# EAGLE design BackscatterPlantSensor_v6_1soic_coax_rmi_2layer (EAGLE 6.4)

## Sheet 1 of 4
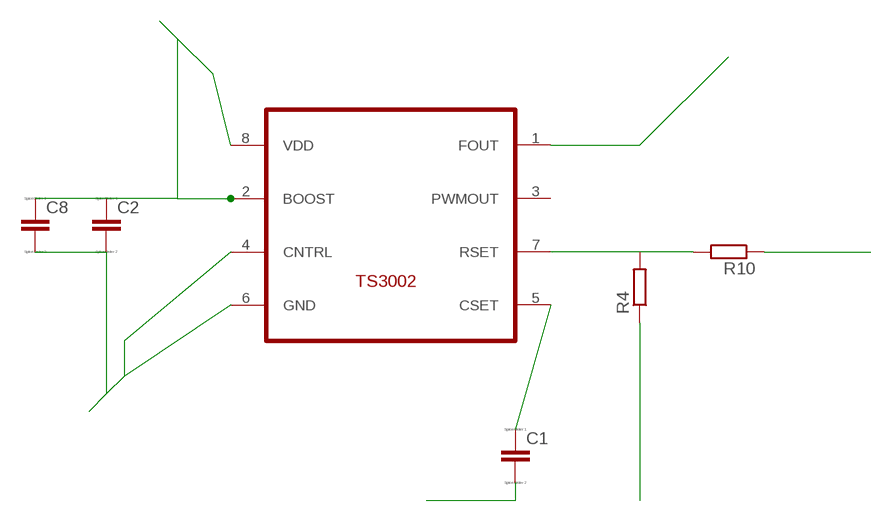
[diagram p0: schematic, sheet 1]

### Parts
C1  CC0603  [C0603]
C2  CC0603  [C0603]
C8  CC0603  [C0603]
R4  R-EU_R0603  [R0603]
R10  R-EU_R0603  [R0603]
U$1  TS3002  [TDFN22-8]

### Nets
AGND: R4.1 ; also sheet 4
DGND: C1.2 C2.2 C8.2 U$1.4(CNTRL) U$1.6(GND) ; also sheet 2
FOUT: U$1.1(FOUT) ; also sheet 2
N$1: C1.1 U$1.5(CSET)
N$2: R4.2 R10.2 U$1.7(RSET)
VCOND: R10.1 ; also sheet 4
VDD: C2.1 C8.1 U$1.2(BOOST) U$1.8(VDD) ; also sheet 3,4
Unconnected: U$1.3(PWMOUT)

## Sheet 2 of 4
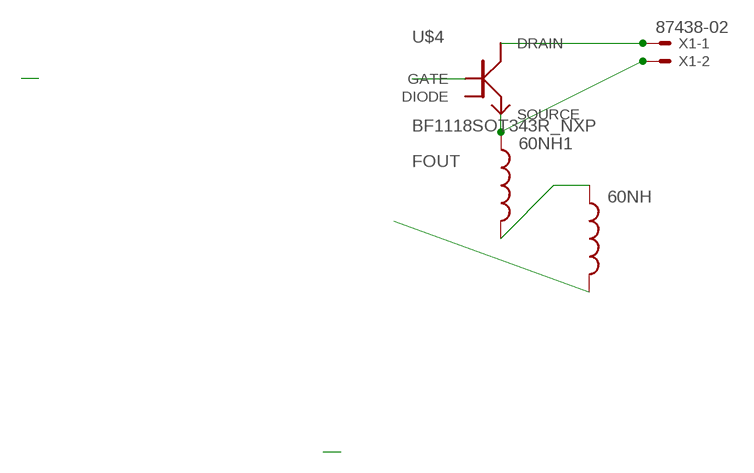
[diagram p1: schematic, sheet 2]

### Parts
60NH  INDUCTOR0402  [C0402]
60NH1  INDUCTOR0402  [C0402]
U$4  BF1118SOT343R_NXP  [SOT343R]
X1  87438-02  [87438-02]

### Nets
DGND: U$4.1(GATE) ; also sheet 1
FOUT: 60NH.2 ; also sheet 1
N$3: 60NH1.2 60NH.1
RF_MINUS: 60NH1.1 U$4.3(SOURCE) X1.2
RF_PLUS: U$4.4(DRAIN) X1.1
Unconnected: U$4.2(DIODE)

## Sheet 3 of 4
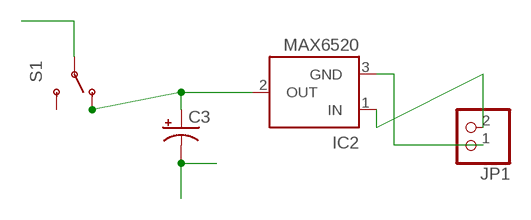
[diagram p2: schematic, sheet 3]

### Parts
C3  CAP_POL1206  [EIA3216]
IC2  MAX6520  [SOT23]
JP1  PINHD-1X2  [1X02]
S1  SWITCH-SPDTPTH  [SWITCH-SPDT]

### Nets
GND: C3.C(-) IC2.3(GND) JP1.1
N$4: IC2.1(IN) JP1.2
N$7: C3.A(+) IC2.2(OUT) S1.1(O)
VDD: S1.2(P) ; also sheet 1,4
Unconnected: S1.3(S)

## Sheet 4 of 4
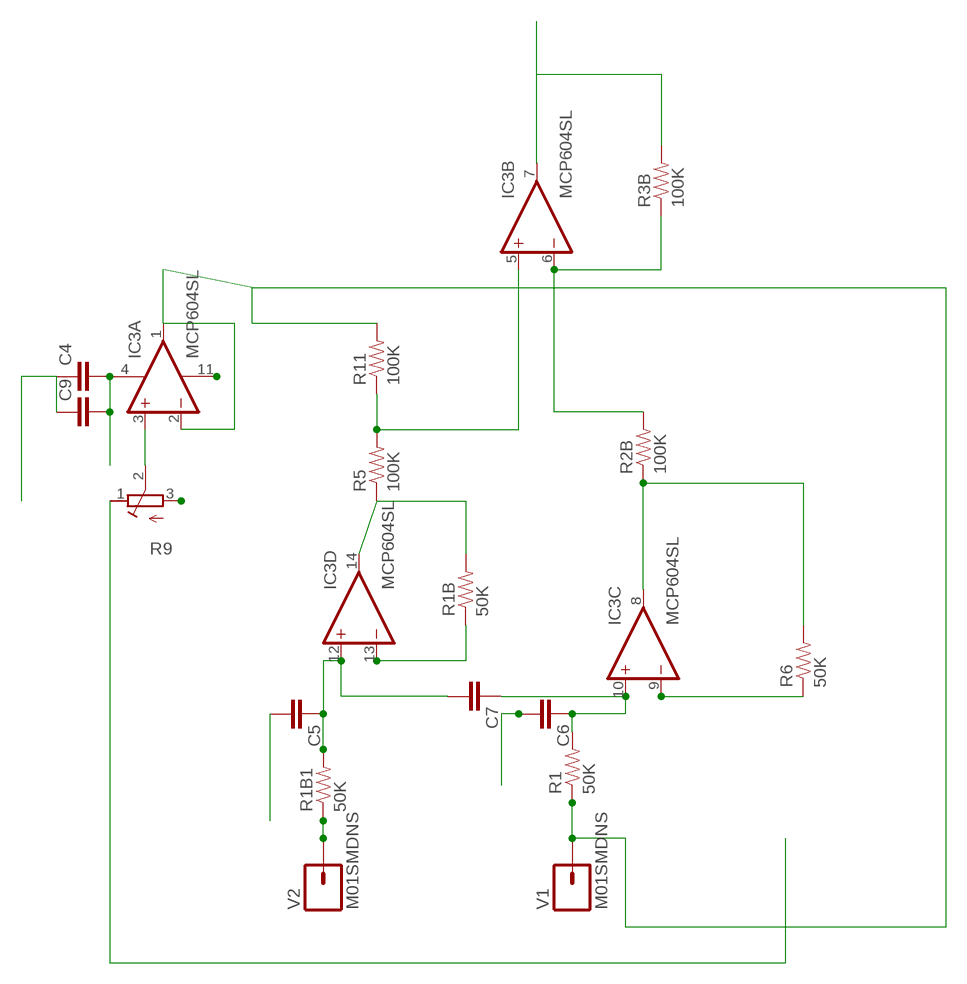
[diagram p3: schematic, sheet 4]

### Parts
C4  CAP0603-CAP  [0603-CAP]
C5  CAP0603-CAP  [0603-CAP]
C6  CAP0603-CAP  [0603-CAP]
C7  CAP0603-CAP  [0603-CAP]
C9  CAP0603-CAP  [0603-CAP]
IC3  MCP604SL  [SO14]
R1  50K  RESISTOR  [0805]
R1B  50K  RESISTOR  [0805]
R1B1  50K  RESISTOR  [0805]
R2B  100K  RESISTOR  [0805]
R3B  100K  RESISTOR  [0805]
R5  100K  RESISTOR  [0805]
R6  50K  RESISTOR  [0805]
R9  R-TRIMM3314G  [RTRIM3314G]
R11  100K  RESISTOR  [0805]
V1  M01SMDNS  [1X01NS]
V2  M01SMDNS  [1X01NS]

### Nets
AGND: C4.1 C5.2 C6.2 C9.1 IC3.11(P:V-) R9.3(A) ; also sheet 1
N$10: IC3.9(C:-IN) R6.1
N$12: C5.1 C7.2 IC3.12(D:+IN) R1B1.2
N$13: R1B1.1 V2.1
N$23: IC3.8(C:OUT) R2B.1 R6.2
N$49: IC3.14(D:OUT) R1B.2 R5.1
N$58: IC3.6(B:-IN) R2B.2 R3B.1
N$84: C6.1 C7.1 IC3.10(C:+IN) R1.2
N$105: IC3.3(A:+IN) R9.2(S)
N$107: IC3.13(D:-IN) R1B.1
N$118: IC3.5(B:+IN) R5.2 R11.1
VCOND: IC3.7(B:OUT) R3B.2 ; also sheet 1
VDD: C4.2 C9.2 IC3.4(P:V+) R9.1(E) ; also sheet 1,3
VRF1: IC3.1(A:OUT) IC3.2(A:-IN) R1.1 R11.2 V1.1

## Library data of the parts
60NH 60NH1 = SparkFun:INDUCTOR: Inductors Basic Inductor/Choke - 0603 and 1206. Footprints are not proven and vary greatly between part numbers.
C1 C2 C8 = eagle-ltspice:C: CAPACITOR, European symbol; SPICEMODEL: NONE; SPICEPREFIX: C
C3 = SparkFun-Capacitors:CAP_POL: Capacitor Polarized These are standard SMD and PTH capacitors. Normally 10uF, 47uF, and 100uF in electrolytic and tantalum varieties. Always verify the external diameter of the through hole cap, it varies with capacity, voltage, and manufacturer. The EIA devices should be standard.
C4-C7 C9 = SparkFun-Passives:CAP: Capacitor Standard 0603 ceramic capacitor, and 0.1" leaded capacitor.
IC2 = maxim:MAX6520: 1.2V Voltage Reference 50ppm/°C, SOT23, 3-Terminal Source: Data sheet <http://datasheets.maxim-ic.com/en/ds/MAX6520.pdf>; MF: MAXIM; MPN: MAX6520EUR-T; OC_FARNELL: unknown; OC_NEWARK: 02J4586
IC3 = linear:MCP604: Quad Op Amp 2.7V to 6.0V Single Supply CMOS Source: http://ww1.microchip.com/downloads/en/DeviceDoc/21314g.pdf
JP1 = pinhead:PINHD-1X2: PIN HEADER
R1 R1B R1B1 R2B R3B R5 R6 R11 = SparkFun:RESISTOR: Resistor Basic schematic elements and footprints for 0603, 1206, and PTH 1/10th watt (small) resistors.
R4 R10 = rcl:R-EU_: RESISTOR, European symbol
R9 = rcl:R-TRIMM: Trimm resistor
S1 = semipassiveTag_library:SWITCH-SPDT: SPST Switch Simple slide switch. Spark Fun Electronics SKU : COM-00102
U$1 = ts3002TDFN22_8pin:TS3002
U$4 = rf_transistors:BF1118
V1 V2 = SparkFun-Connectors:M01: Header 1 Standard 1-pin 0.1" header. Use with straight break away headers (SKU : PRT-00116), right angle break away headers (PRT-00553), swiss pins (PRT-00743), machine pins (PRT-00117), and female headers (PRT-00115).
X1 = con-molex:87438-02: Wire-to-Board 1.50mm (.059") Pitch Header - Right Angle, SMT, Shrouded Source: http://www.molex.com/product/micro/87438.html; OC_FARNELL: 1711327; OC_NEWARK: unknown

## Board
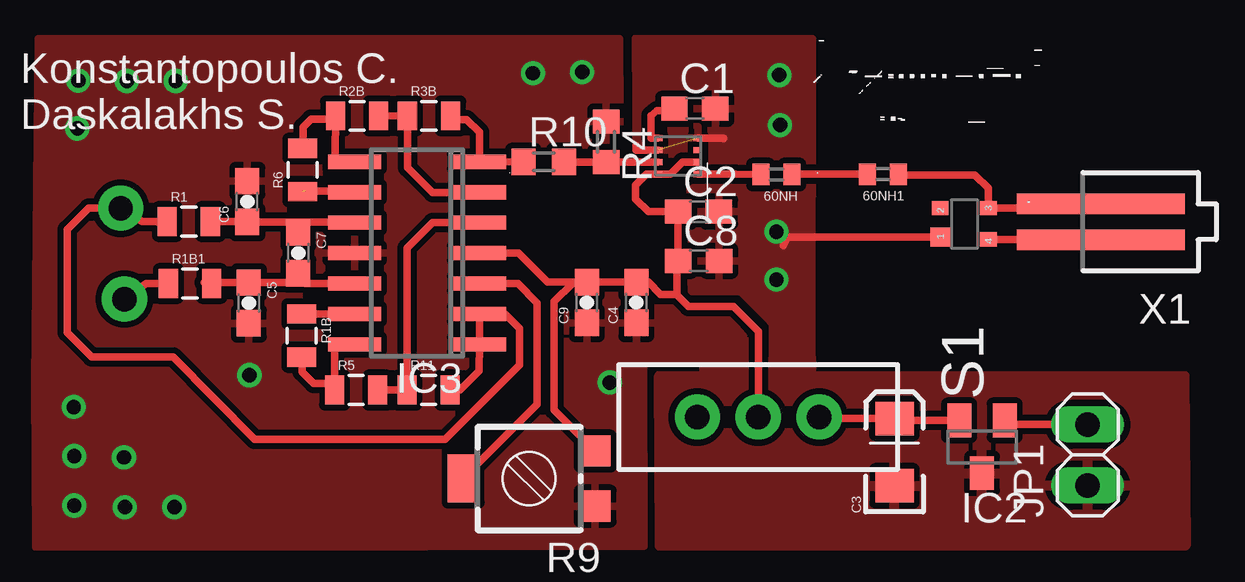
[diagram p4: board, top side]
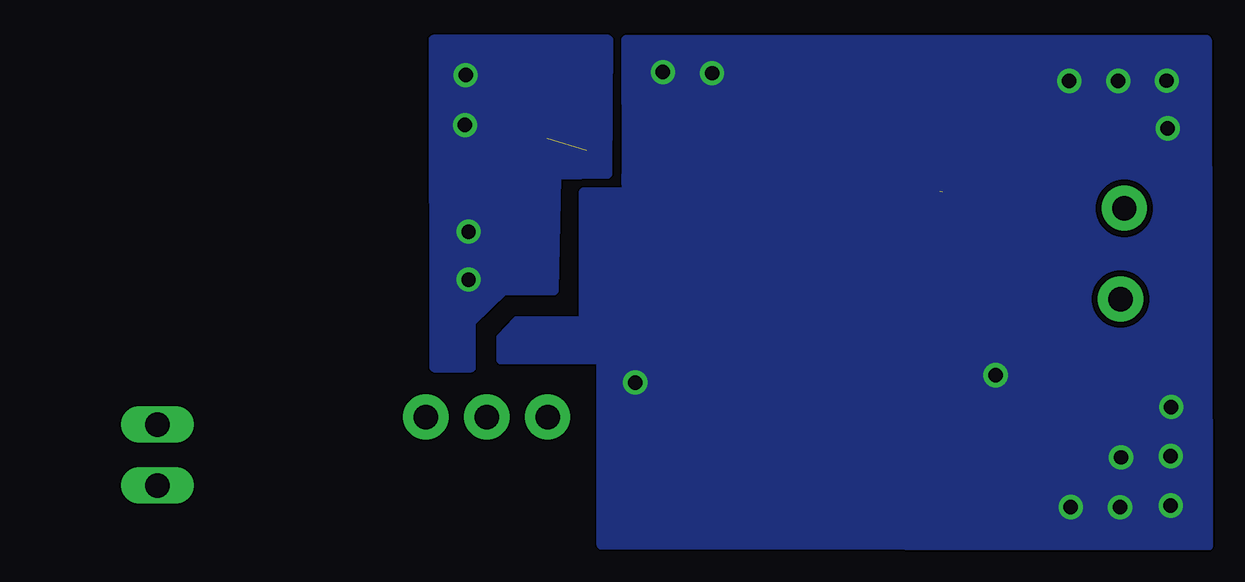
[diagram p5: board, bottom side, seen from below]

No outline drawn. Coordinates in mm, seen from the top.
Copper layers (1*16): Top 0.035mm / dielectric 1.5mm / Bottom 0.035mm
Design rules "default *": minimum track width 10mil, minimum drill 24mil, track to track 10mil, track to pad 10mil, pad to pad 10mil, via to via 10mil, smd to smd 10mil, copper to edge 40mil, drill to drill 8mil, minimum pad ring 10mil, minimum via ring 8mil, stop-mask expansion 4mil, vias tented up to drill 0mil, thermal gap 10mil

### Footprints (pad centres in the part's own frame; a part is rotated, then mirrored left to right if it is on the bottom)
C0402 = smd 0.7 x 0.9: 1 -0.65,0; 2 0.65,0
C0603 = smd 1.1 x 1: 1 -0.85,0; 2 0.85,0
EIA3216 = smd 1.4 x 1.6: A 1.4,0; C -1.4,0
0603-CAP = smd 1.1 x 1: 1 -0.85,0; 2 0.85,0
SOT23 = smd 1 x 1.4: 1 -0.95,-1.1; 2 0.95,-1.1; 3 0,1.1
SO14 = smd 0.6 x 2.2: 1 -3.81,-2.6; 2 -2.54,-2.6; 3 -1.27,-2.6; 4 0,-2.6; 5 1.27,-2.6; 6 2.54,-2.6; 7 3.81,-2.6; 8 3.81,2.6; 9 2.54,2.6; 10 1.27,2.6; 11 0,2.6; 12 -1.27,2.6; 13 -2.54,2.6; 14 -3.81,2.6
1X02 = drill 1.016 long: 1 -1.27,0; 2 1.27,0
0805 = smd 0.8 x 1.2: 1 -0.9,0; 2 0.9,0
R0603 = smd 1 x 1.1: 1 -0.85,0; 2 0.85,0
RTRIM3314G = smd 1.3 x 1.3: 1 1.15,-2.75; 3 -1.15,-2.75 | smd 2 x 1.3: 2 0,2.75
SWITCH-SPDT = drill 1.016 pad 1.88: 1 0,2.54; 2 0,0; 3 0,-2.54
TDFN22-8 = smd 0.35 x 0.25: 1 -1.78,-0.7; 2 -1.78,-1.2; 3 -1.78,-1.7; 4 -1.78,-2.2; 5 -0.13,-2.2; 6 -0.13,-1.7; 7 -0.13,-1.2; 8 -0.13,-0.7
SOT343R = smd 0.8 x 0.8: 1 0.55,-1.07 | smd 0.6 x 0.7: 2 -0.66,-1.07; 3 -0.66,0.94; 4 0.65,0.94
1X01NS = drill 1.016 pad 1.88: 1 0,0
87438-02 = smd 7 x 0.85: 1 0,0.75; 2 0,-0.75

### Placement (x,y rotation side)
60NH  77.52,63.75 180 top
60NH1  81.96,63.76 180 top
C1  74.12,66.49 0 top
C2  74.27,62.19 0 top
C3  82.44,52.17 90 top
C4  71.68,58.41 90 top
C5  55.53,58.39 270 top
C6  55.46,62.62 90 top
C7  57.59,60.48 270 top
C8  74.28,60.14 0 top
C9  69.62,58.41 90 top
IC2  86.09,52.39 180 top
IC3  62.54,60.47 90 top
JP1  90.49,52.05 90 top
R1  53.03,61.78 0 top
R1B  57.73,57.03 270 top
R1B1  53.08,59.2 0 top
R2B  60.04,66.19 0 top
R3B  63.04,66.19 0 top
R4  70.42,65.11 270 top
R5  60,54.76 0 top
R6  57.78,63.93 90 top
R9  67.21,51.07 90 top
R10  67.82,64.27 0 top
R11  63.02,54.76 0 top
S1  76.76,53.63 270 top
U$1  72.46,63.06 180 top
U$4  85.41,61.69 270 top
V1  50.18,62.34 0 top
V2  50.34,58.55 0 top
X1  91.05,61.78 180 top

### Tracks (layer width: path | path; a pad name or v marks a point on that pad's centre or on a via)
AGND  (via drill 0.6)
  other vias: 70.57,55.07 55.55,55.38 48.23,54.05 48.25,52 48.25,49.94 50.32,51.95 50.36,49.87 52.42,49.88 48.38,65.67 48.42,67.66 50.44,67.65 52.48,67.65 67.37,67.97 69.42,68.02
  pour Top: 71.98,56.07 76.22,56.05 76.15,57.01 75.51,57.72 73.48,57.83 72.02,60.38 72.05,63 71.95,63.13 71.01,63.12 70.97,69.4 46.74,69.4 46.61,55.04 46.64,48.2 62.92,48.22 72,48.24
  pour Bottom: 70.94,69.36 46.75,69.36 46.7,48.26 71.97,48.3 71.97,56.03 76.15,56.03 76.15,56.95 75.47,57.66 72.7,57.64 72.71,63.01 70.91,63.01 70.93,63.6 70.91,63.98
DGND  (via drill 0.6)  (1 unrouted)
  Top 0.254: U$1.4 74.76,65.26 74.78,65.28
  Top 0.305: C2.2 74.72,61.84 | U$4.1 77.98,61.14 77.81,60.78 | U$1.6 71.67,64.76 71.67,64.95 | U$1.4 75.32,65.26 75.32,65.25
  other vias: 77.67,65.81 77.64,67.89 77.52,61.36 77.52,59.36
  pour Top: 71.64,69.43 71.69,63.79 74.3,63.95 74.29,63.35 73.81,63.04 73.97,58.85 76.03,58.86 78.41,56.44 78.99,56.16 79.03,69.4
  pour Bottom: 71.69,69.36 78.98,69.36 78.95,55.71 77.41,55.71 77.41,57.59 76.05,58.93 73.96,58.91 73.85,63.62 73.83,63.74 71.79,63.78 71.73,63.77
FOUT
  Top 0.305: U$1.1 75.82,63.76 60NH.2
GND
  pour Top: 72.63,55.35 94.52,55.36 94.58,48.27 72.66,48.26
N$1
  Top 0.305: U$1.5 72.33,65.26 72.29,65.26 72.29,66.19 72.55,66.41 73.19,66.41 C1.1
N$2
  Top 0.305: R10.2 69.04,64.25 R4.2 71.11,64.26 U$1.7
N$3
  Top 0.305: 60NH1.2 78.49,63.76 60NH.1
N$4
  Top 0.305: 87.05,53.3 87.07,53.32 JP1.2
  Top 0.406: 87.05,53.3 IC2.1
N$7
  Top 0.305: IC2.2 82.71,53.5 C3.A 79.28,53.57 79.25,53.6
  Top 0.406: 79.25,53.6 S1.1
N$10  (1 unrouted)
  Top 0.305: IC3.9 59.89,63.06 57.88,63.06
N$12
  Top 0.305: IC3.12 57.88,59.2 C7.2 57.18,59.24 C5.1 53.67,59.24 R1B1.2
N$13
  Top 0.305: V2.1 51.25,59.2 R1B1.1
N$14
  pour Top: 76.68,56.8 76.71,54.91 74.45,54.85 74.45,56.83
N$21
  pour Top: 77.33,54.88 77.35,57.38 79,57.38 79.03,54.95 78.19,54.8 77.92,54.8
N$23
  Top 0.254: R2B.1 59.1,66.2
  Top 0.305: R6.2 57.79,65.73 58.13,66.06 58.92,66.06 R2B.1 59.13,64.51 59.34,64.3 59.92,64.3 IC3.8
N$49
  Top 0.305: R1B.2 57.75,55.5 58.22,55.03 58.82,55.03 R5.1 59.11,56.74 59.86,56.74 IC3.14
N$58
  Top 0.305: IC3.6 63.19,63 62.15,64.04 R3B.1 62.17,66.18 R2B.2
N$84
  Top 0.305: IC3.10 60.45,61.77 57.57,61.77 | 57.57,61.77 C6.1 55.44,61.79 R1.2 | 57.57,61.77 57.52,61.33 C7.1
N$105
  Top 0.305: IC3.3 66.74,59.2 67.54,58.39 67.54,54.16 R9.2
N$107
  Top 0.305: IC3.13 R1B.1
N$118
  Top 0.305: R11.1 62.13,60.69 63.18,61.74 IC3.5 | R5.2 R11.1 | 62.17,54.76 R11.1
RF_MINUS
  Top 0.305: X1.2 87.89,62.35 U$4.3 86.35,63.17 85.79,63.73 82.64,63.73 60NH1.1
  Top 0.406: 82.82,63.74 60NH1.1
RF_PLUS
  Top 0.305: U$4.4 88.05,61.04 X1.1
VCOND
  Top 0.305: R10.1 67.13,64.27 IC3.7 65.14,65.51 64.61,66.04 63.95,66.04 R3B.2
VDD
  Top 0.305: U$1.2 73.6,64.26 73.1,63.76 U$1.8 72.1,63.76 71.64,63.31 71.64,62.72 72.18,62.19 C2.1 73.42,60.15 C8.1 73.38,60.09 73.38,58.73 | S1.2 76.76,57.21 75.73,58.25 73.85,58.25 73.38,58.73 | R9.1 68.25,53.93 68.25,58.44 69.04,59.23 C9.2 | C9.2 C4.2 72.18,59.26 72.69,58.74 73.37,58.74 73.38,58.73 | C9.2 67.98,59.26 66.78,60.47 IC3.4
VRF1
  Top 0.305: R11.2 64.33,54.76 65.13,55.56 IC3.1 IC3.2 66.21,57.93 66.81,57.33 66.81,55.81 63.7,52.71 55.77,52.71 52.38,56.14 48.97,56.14 47.96,57.16 47.96,61.44 48.85,62.34 V1.1 51.08,61.78 R1.1 51.78,61.75

### Text on the board
tPlace: Konstantopoulos C. / Daskalakhs S.